# Altium project Control.PrjPCB
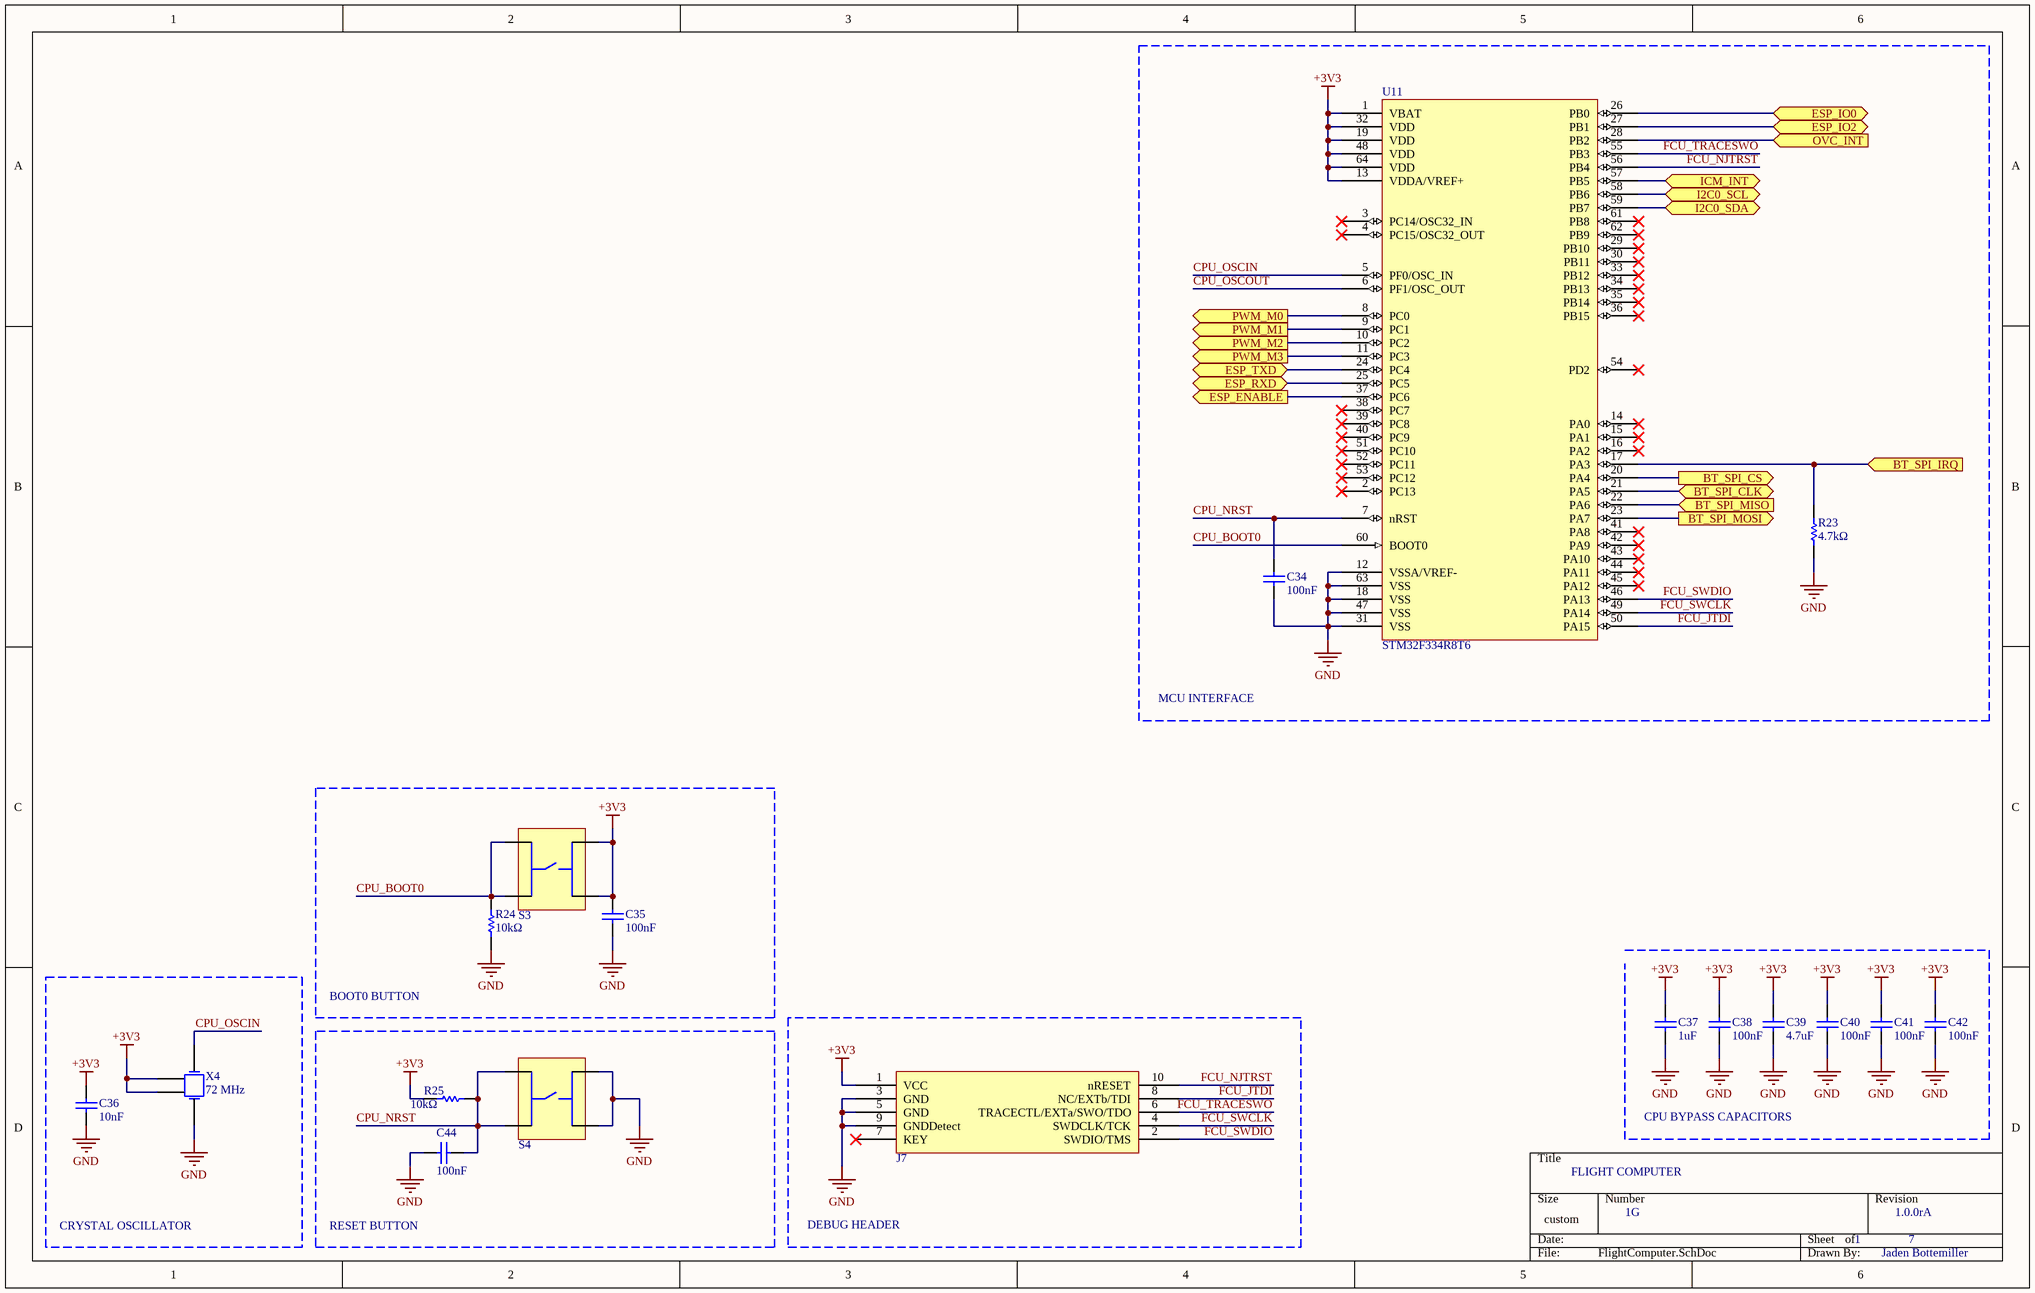
[diagram p0: FlightComputer.SchDoc]
7 sheets, 196 parts. Net scope: flat (ports and power ports of the same name join across sheets).
Sheets:
  FlightComputer.SchDoc
  DebugProbe.SchDoc
  MotionSense.SchDoc
  WirelessConnectivity.SchDoc
  BluetoothConnectivity.SchDoc
  PowerRegulation.SchDoc
  AuxilliaryLEDs.SchDoc

## Sheet FlightComputer.SchDoc
size 381 x 241 mm

### Parts
C34  value 100nF  (hidden comment: CAP)
C35  value 100nF  (hidden comment: CAP)
C36  value 10nF  (hidden comment: CAP)
C37  value 1uF  (hidden comment: CAP)
C38  value 100nF  (hidden comment: CAP)
C39  value 4.7uF  (hidden comment: CAP)
C40  value 100nF  (hidden comment: CAP)
C41  value 100nF  (hidden comment: CAP)
C42  value 100nF  (hidden comment: CAP)
C44  value 100nF  (hidden comment: CAP)
J7  Debug Connector  (value not drawn)
R23  value 4.7kΩ  (hidden comment: RES)
R24  value 10kΩ  (hidden comment: RES)
R25  value 10kΩ  (hidden comment: RES)
S3  Pushbutton  (value not drawn)
S4  Pushbutton  (value not drawn)
U11  STM32F334R8T6
X4  value 72 MHz  (hidden comment: Crystal Oscillator)

### Blocks framed on the sheet
MCU INTERFACE: C34 R23 U11
BOOT0 BUTTON: C35 R24 S3
CRYSTAL OSCILLATOR: C36 X4
RESET BUTTON: C44 R25 S4
DEBUG HEADER: J7

### Ports
BT_SPI_CLK (bidir), BT_SPI_CS (out), BT_SPI_IRQ (in), BT_SPI_MISO (in), BT_SPI_MOSI (out), ESP_ENABLE (out), ESP_IO0 (bidir), ESP_IO2 (bidir), ESP_RXD (bidir), ESP_TXD (bidir), I2C0_SCL (bidir), I2C0_SDA (bidir), ICM_INT (bidir), OVC_INT (in), PWM_M0 (out), PWM_M1 (out), PWM_M2 (out), PWM_M3 (out)

### Nets
+3V3: C35.1 C36.1 C37.2 C38.2 C39.2 C40.2 C41.2 C42.2 J7.1(VCC) R25.1 S3.3(Pin) S3.4(Pin) U11.1(VBAT) U11.13(VDDA/VREF+) U11.19(VDD) U11.32(VDD) U11.48(VDD) U11.64(VDD) X4.2(GND) X4.4(GND)  [project net VDDA_WA]
GND: C34.1 C35.2 C36.2 C37.1 C38.1 C39.1 C40.1 C41.1 C42.1 C44.2 J7.3(GND) J7.5(GND) J7.9(GNDDetect) R23.1 R24.1 S4.3(Pin) S4.4(Pin) U11.12(VSSA/VREF-) U11.18(VSS) U11.31(VSS) U11.47(VSS) U11.63(VSS) X4.3(X2)  [project net BT_NO_SMPS]
CPU_BOOT0: R24.2 S3.1 S3.2(Pin) U11.60(BOOT0)
CPU_NRST: C34.2 C44.1 R25.2 S4.1 S4.2(Pin) U11.7(nRST)
CPU_OSCIN: U11.5(PF0/OSC_IN) X4.1(X1)
CPU_OSCOUT: U11.6(PF1/OSC_OUT)
FCU_JTDI: J7.8(NC/EXTb/TDI) U11.50(PA15)
FCU_NJTRST: J7.10(nRESET) U11.56(PB4)
FCU_SWCLK: J7.4(SWDCLK/TCK) U11.49(PA14)
FCU_SWDIO: J7.2(SWDIO/TMS) U11.46(PA13)
FCU_TRACESWO: J7.6(TRACECTL/EXTa/SWO/TDO) U11.55(PB3)
NetJ2_3: U11.21(PA5) ; port BT_SPI_CLK
NetJ2_4: U11.23(PA7) ; port BT_SPI_MOSI
NetJ2_5: U11.22(PA6) ; port BT_SPI_MISO
NetJ2_6: U11.20(PA4) ; port BT_SPI_CS
NetJ2_7: R23.2 U11.17(PA3) ; port BT_SPI_IRQ
NetJ8_4: U11.8(PC0) ; port PWM_M0
NetJ8_5: U11.9(PC1) ; port PWM_M1
NetJ8_6: U11.10(PC2) ; port PWM_M2
NetJ8_7: U11.11(PC3) ; port PWM_M3
NetJ8_10: U11.58(PB6) ; port I2C0_SCL
NetJ8_11: U11.59(PB7) ; port I2C0_SDA
NetJ8_12: U11.28(PB2) ; port OVC_INT
NetJ10_3: U11.24(PC4) ; port ESP_TXD
NetJ10_4: U11.37(PC6) ; port ESP_ENABLE
NetJ10_6: U11.27(PB1) ; port ESP_IO2
NetJ10_7: U11.26(PB0) ; port ESP_IO0
NetJ10_8: U11.25(PC5) ; port ESP_RXD
NetU11_57: U11.57(PB5) ; port ICM_INT

Not connected (* = marked no-connect by the designer): J7 7(KEY)*; U11 2(PC13)* 3(PC14/OSC32_IN)* 4(PC15/OSC32_OUT)* 14(PA0)* 15(PA1)* 16(PA2)* 29(PB10)* 30(PB11)* 33(PB12)* 34(PB13)* 35(PB14)* 36(PB15)* 38(PC7)* 39(PC8)* 40(PC9)* 41(PA8)* 42(PA9)* 43(PA10)* 44(PA11)* 45(PA12)* 51(PC10)* 52(PC11)* 53(PC12)* 54(PD2)* 61(PB8)* 62(PB9)*

### Notes on the sheet
- FLIGHT COMPUTER
- CPU BYPASS CAPACITORS
- 1G
- 1
- 1.0.0rA
- 7
- Jaden Bottemiller

### Library data of the parts
C34-C42 C44 = CAP: Standard Capacitor
J7 = Cortex-M Debug: 10-Pin Cortex-M Debug Connector
R23-R25 = RES: Standard Resistor
S3 S4 = PUSHBTN_4T: Standard Pushbutton with 4 Terminals
U11 = STM32F334R8T6: ARM® Cortex®-M4 STM32F3 Microcontroller IC 32-Bit 72MHz 64KB (64K x 8) FLASH 64-LQFP (10x10); ComponentLink1Description: DigiKey; ComponentLink1URL: https://www.digikey.com/product-detail/en/stmicroelectronics/STM32F334R8T6/497-14955-ND/4989177; ComponentLink2Description: Datasheet; ComponentLink2URL: https://www.st.com/content/ccc/resource/technical/document/datasheet/d1/cd/3d/18/a2/2c/4e/d0/DM00097745.pdf/files/DM00097745.pdf/jcr:content/translations/en.DM00097745.pdf
X4 = OSC_2GND: Standard Crystal Oscillator with two ground connections.

## Sheet DebugProbe.SchDoc
size 381 x 241 mm
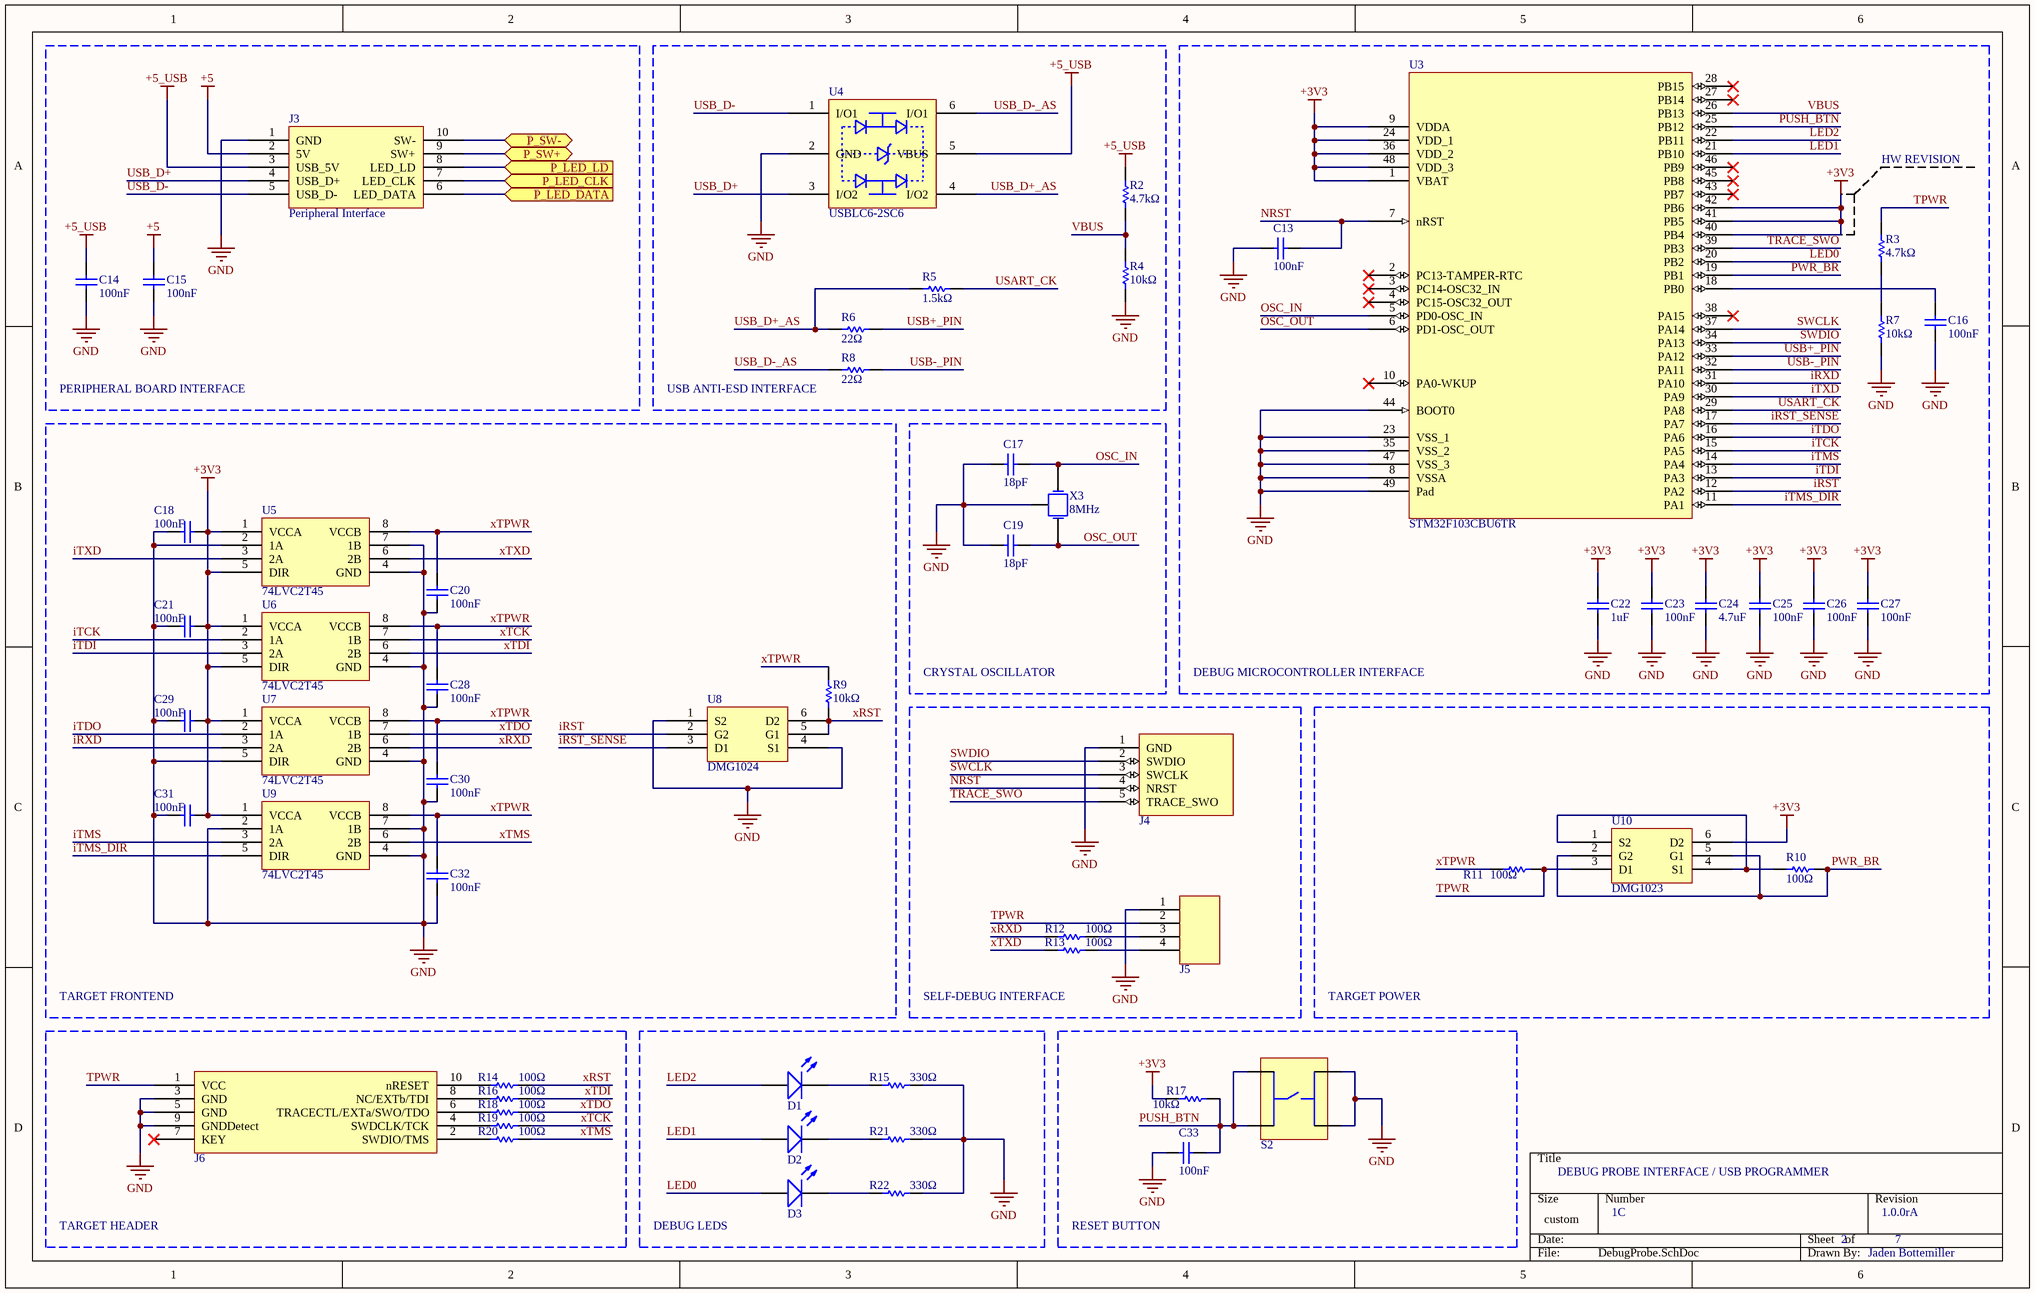
[diagram p1: DebugProbe.SchDoc]

### Parts
C13  value 100nF  (hidden comment: CAP)
C14  value 100nF  (hidden comment: CAP)
C15  value 100nF  (hidden comment: CAP)
C16  value 100nF  (hidden comment: CAP)
C17  value 18pF  (hidden comment: CAP)
C18  value 100nF  (hidden comment: CAP)
C19  value 18pF  (hidden comment: CAP)
C20  value 100nF  (hidden comment: CAP)
C21  value 100nF  (hidden comment: CAP)
C22  value 1uF  (hidden comment: CAP)
C23  value 100nF  (hidden comment: CAP)
C24  value 4.7uF  (hidden comment: CAP)
C25  value 100nF  (hidden comment: CAP)
C26  value 100nF  (hidden comment: CAP)
C27  value 100nF  (hidden comment: CAP)
C28  value 100nF  (hidden comment: CAP)
C29  value 100nF  (hidden comment: CAP)
C30  value 100nF  (hidden comment: CAP)
C31  value 100nF  (hidden comment: CAP)
C32  value 100nF  (hidden comment: CAP)
C33  value 100nF  (hidden comment: CAP)
D1  LED  (value not drawn)
D2  LED  (value not drawn)
D3  LED  (value not drawn)
J3  Peripheral Interface
J4  Debug Header  (value not drawn)
J5  4 Pin Connector  (value not drawn)
J6  Debug Connector  (value not drawn)
R2  value 4.7kΩ  (hidden comment: RES)
R3  value 4.7kΩ  (hidden comment: RES)
R4  value 10kΩ  (hidden comment: RES)
R5  value 1.5kΩ  (hidden comment: RES)
R6  value 22Ω  (hidden comment: RES)
R7  value 10kΩ  (hidden comment: RES)
R8  value 22Ω  (hidden comment: RES)
R9  value 10kΩ  (hidden comment: RES)
R10  value 100Ω  (hidden comment: RES)
R11  value 100Ω  (hidden comment: RES)
R12  value 100Ω  (hidden comment: RES)
R13  value 100Ω  (hidden comment: RES)
R14  value 100Ω  (hidden comment: RES)
R15  value 330Ω  (hidden comment: RES)
R16  value 100Ω  (hidden comment: RES)
R17  value 10kΩ  (hidden comment: RES)
R18  value 100Ω  (hidden comment: RES)
R19  value 100Ω  (hidden comment: RES)
R20  value 100Ω  (hidden comment: RES)
R21  value 330Ω  (hidden comment: RES)
R22  value 330Ω  (hidden comment: RES)
S2  Pushbutton  (value not drawn)
U3  STM32F103CBU6TR
U4  USBLC6-2SC6
U5  74LVC2T45
U6  74LVC2T45
U7  74LVC2T45
U8  DMG1024
U9  74LVC2T45
U10  DMG1023
X3  value 8MHz  (hidden comment: Crystal Oscillator)

### Blocks framed on the sheet
PERIPHERAL BOARD INTERFACE: C14 C15 J3
USB ANTI-ESD INTERFACE: R2 R4-R6 R8 U4
TARGET FRONTEND: C18 C20 C21 C28-C32 R9 U5-U9
CRYSTAL OSCILLATOR: C17 C19 X3
SELF-DEBUG INTERFACE: J4 J5 R12 R13
TARGET POWER: R10 R11 U10
TARGET HEADER: J6 R14 R16 R18-R20
DEBUG LEDS: D1-D3 R15 R21 R22
RESET BUTTON: C33 R17 S2

### Ports
P_LED_CLK (in), P_LED_DATA (in), P_LED_LD (in), P_SW+ (bidir), P_SW- (bidir)

### Nets
+3V3: C18.1 C21.1 C22.2 C23.2 C24.2 C25.2 C26.2 C27.2 C29.1 C31.1 R17.1 U3.1(VBAT) U3.9(VDDA) U3.24(VDD_1) U3.36(VDD_2) U3.40(PB4) U3.41(PB5) U3.42(PB6) U3.48(VDD_3) U5.1(VCCA) U5.5(DIR) U6.1(VCCA) U6.5(DIR) U7.1(VCCA) U9.1(VCCA) U10.6(D2)  [project net VDDA_WA]
+5: C15.2 J3.2(5V)
+5_USB: C14.2 J3.3(USB_5V) R2.2 U4.5(VBUS)
GND: C13.1 C14.1 C15.1 C16.1 C17.2 C18.2 C19.2 C20.2 C21.2 C22.1 C23.1 C24.1 C25.1 C26.1 C27.1 C28.2 C29.2 C30.2 C31.2 C32.2 C33.2 J3.1(GND) J4.1(GND) J5.1(Pin) J6.3(GND) J6.5(GND) J6.9(GNDDetect) R4.1 R7.1 R15.1 R21.1 R22.1 S2.3(Pin) S2.4(Pin) U3.8(VSSA) U3.23(VSS_1) U3.35(VSS_2) U3.44(BOOT0) U3.47(VSS_3) U3.49(Pad) U4.2(GND) U5.2(1A) U5.4(GND) U5.7(1B) U6.4(GND) U7.4(GND) U7.5(DIR) U8.1(S2) U8.4(S1) U9.2(1A) U9.4(GND) U9.7(1B) X3.3(GND)  [project net BT_NO_SMPS]
iRST: U3.12(PA2) U8.2(G2)
iRST_SENSE: U3.17(PA7) U8.3(D1)
iRXD: U3.31(PA10) U7.3(2A)
iTCK: U3.15(PA5) U6.2(1A)
iTDI: U3.13(PA3) U6.3(2A)
iTDO: U3.16(PA6) U7.2(1A)
iTMS: U3.14(PA4) U9.3(2A)
iTMS_DIR: U3.11(PA1) U9.5(DIR)
iTXD: U3.30(PA9) U5.3(2A)
LED0: D3.2(A) U3.20(PB2)
LED1: D2.2(A) U3.21(PB10)
LED2: D1.2(A) U3.22(PB11)
NRST: C13.2 J4.4(NRST) U3.7(nRST)
OSC_IN: C17.1 U3.5(PD0-OSC_IN) X3.1(X1)
OSC_OUT: C19.1 U3.6(PD1-OSC_OUT) X3.2(X2)
PUSH_BTN: C33.1 R17.2 S2.1 S2.2(Pin) U3.25(PB12)
PWR_BR: R10.2 U3.19(PB1) U10.2(G2) U10.5(G1)
SWCLK: J4.3(SWCLK) U3.37(PA14)
SWDIO: J4.2(SWDIO) U3.34(PA13)
TPWR: J5.2(Pin) J6.1(VCC) R3.2 R11.2 U10.3(D1)
TRACE_SWO: J4.5(TRACE_SWO) U3.39(PB3)
USART_CK: R5.1 U3.29(PA8)
USB+_PIN: R6.1 U3.33(PA12)
USB-_PIN: R8.1 U3.32(PA11)
USB_D+: J3.4(USB_D+) U4.3(I/O2)
USB_D+_AS: R5.2 R6.2 U4.4(I/O2)
USB_D-: J3.5(USB_D-) U4.1(I/O1)
USB_D-_AS: R8.2 U4.6(I/O1)
VBUS: R2.1 R4.2 U3.26(PB13)
xRST: R9.2 R14.1 U8.5(G1) U8.6(D2)
xRXD: R12.2 U7.6(2B)
xTCK: R19.1 U6.7(1B)
xTDI: R16.1 U6.6(2B)
xTDO: R18.1 U7.7(1B)
xTMS: R20.1 U9.6(2B)
xTPWR: C20.1 C28.1 C30.1 C32.1 R9.1 R11.1 U5.8(VCCB) U6.8(VCCB) U7.8(VCCB) U9.8(VCCB)
xTXD: R13.2 U5.6(2B)
NetC16_2: C16.2 U3.18(PB0)
NetD1_1: D1.1(K) R15.2
NetD2_1: D2.1(K) R21.2
NetD3_1: D3.1(K) R22.2
NetJ3_6: J3.6(LED_DATA) ; port P_LED_DATA
NetJ3_7: J3.7(LED_CLK) ; port P_LED_CLK
NetJ3_8: J3.8(LED_LD) ; port P_LED_LD
NetJ3_9: J3.9(SW+) ; port P_SW+
NetJ3_10: J3.10(SW-) ; port P_SW-
NetJ5_3: J5.3(Pin) R12.1
NetJ5_4: J5.4(Pin) R13.1
NetJ6_2: J6.2(SWDIO/TMS) R20.2
NetJ6_4: J6.4(SWDCLK/TCK) R19.2
NetJ6_6: J6.6(TRACECTL/EXTa/SWO/TDO) R18.2
NetJ6_8: J6.8(NC/EXTb/TDI) R16.2
NetJ6_10: J6.10(nRESET) R14.2
NetR3_1: R3.1 R7.2
NetR10_1: R10.1 U10.1(S2) U10.4(S1)

Not connected (* = marked no-connect by the designer): J6 7(KEY)*; U3 2(PC13-TAMPER-RTC)* 3(PC14-OSC32_IN)* 4(PC15-OSC32_OUT)* 10(PA0-WKUP)* 27(PB14)* 28(PB15)* 38(PA15)* 43(PB7)* 45(PB8)* 46(PB9)*

### Notes on the sheet
- HW REVISION
- DEBUG MICROCONTROLLER INTERFACE
- DEBUG PROBE INTERFACE / USB PROGRAMMER
- 1C
- 2
- 1.0.0rA
- 7
- Jaden Bottemiller

### Library data of the parts
C13-C33 = CAP: Standard Capacitor
D1 = LED: Standard LED
D2 = LED: Standard LED; Color: Orange
D3 = LED: Standard LED; Color: YELLOW
J3 = PERIPHERAL_INTERFACE: Interface between peripheral board and control board.
J4 = DBG_5PIN: Five pin Debug Header SWD
J5 = CONN_4PIN: Standard 4 Pin Connector
J6 = Cortex-M Debug: 10-Pin Cortex-M Debug Connector
R2-R22 = RES: Standard Resistor
S2 = PUSHBTN_4T: Standard Pushbutton with 4 Terminals
U3 = STM32F103CBU6TR: IC MCU 32BIT 128KB FLASH LQFP48; ComponentLink1Description: DigiKey; ComponentLink1URL: https://www.digikey.com/product-detail/en/stmicroelectronics/STM32F103CBU6TR/497-18757-1-ND/9958418; ComponentLink2Description: Datasheet; ComponentLink2URL: https://www.st.com/resource/en/datasheet/stm32f103cb.pdf
U4 = USBLC6-2: 17V Clamp 5A (8/20µs) Ipp TVS Diode; ComponentLink1Description: DigiKey; ComponentLink1URL: https://www.digikey.com/product-detail/en/stmicroelectronics/USBLC6-2SC6/497-5235-1-ND/1121688; ComponentLink2Description: Datasheet; ComponentLink2URL: https://www.st.com/content/ccc/resource/technical/document/datasheet/06/1d/48/9c/6c/20/4a/b2/CD00050750.pdf/files/CD00050750.pdf/jcr:content/translations/en.CD00050750.pdf
U5-U7 U9 = 74LVC2T45: Voltage Level Translator Bidirectional 1 Circuit 2 Channel 420Mbps 8-XSON; ComponentLink1Description: DigiKey; ComponentLink1URL: https://www.digikey.com/product-detail/en/nexperia-usa-inc/74LVC2T45GT115/1727-4581-1-ND/2530960; ComponentLink2Description: Datasheet; ComponentLink2URL: https://assets.nexperia.com/documents/data-sheet/74LVC_LVCH2T45.pdf
U8 = DMG1024: Mosfet Array 2 N-Channel (Dual) 20V 1.38A 530mW Surface Mount SOT-563; ComponentLink3Description: DigiKey; ComponentLink3URL: https://www.digikey.com/product-detail/en/diodes-incorporated/DMG1024UV-7/DMG1024UV-7DICT-ND/2270855; ComponentLink4Description: Datasheet; ComponentLink4URL: https://www.diodes.com/assets/Datasheets/ds31974.pdf
U10 = DMG1023: Mosfet Array 2 P-Channel (Dual) 20V 1.03A 530mW Surface Mount SOT-563; ComponentLink1Description: DigiKey; ComponentLink1URL: https://www.digikey.com/product-detail/en/diodes-incorporated/DMG1023UV-7/DMG1023UV-7DICT-ND/2270854; ComponentLink2Description: Datasheet; ComponentLink2URL: https://www.diodes.com/assets/Datasheets/ds31975.pdf
X3 = OSC_1GND: Standard Crystal Oscillator with a ground connection.

## Sheet MotionSense.SchDoc
size 381 x 241 mm
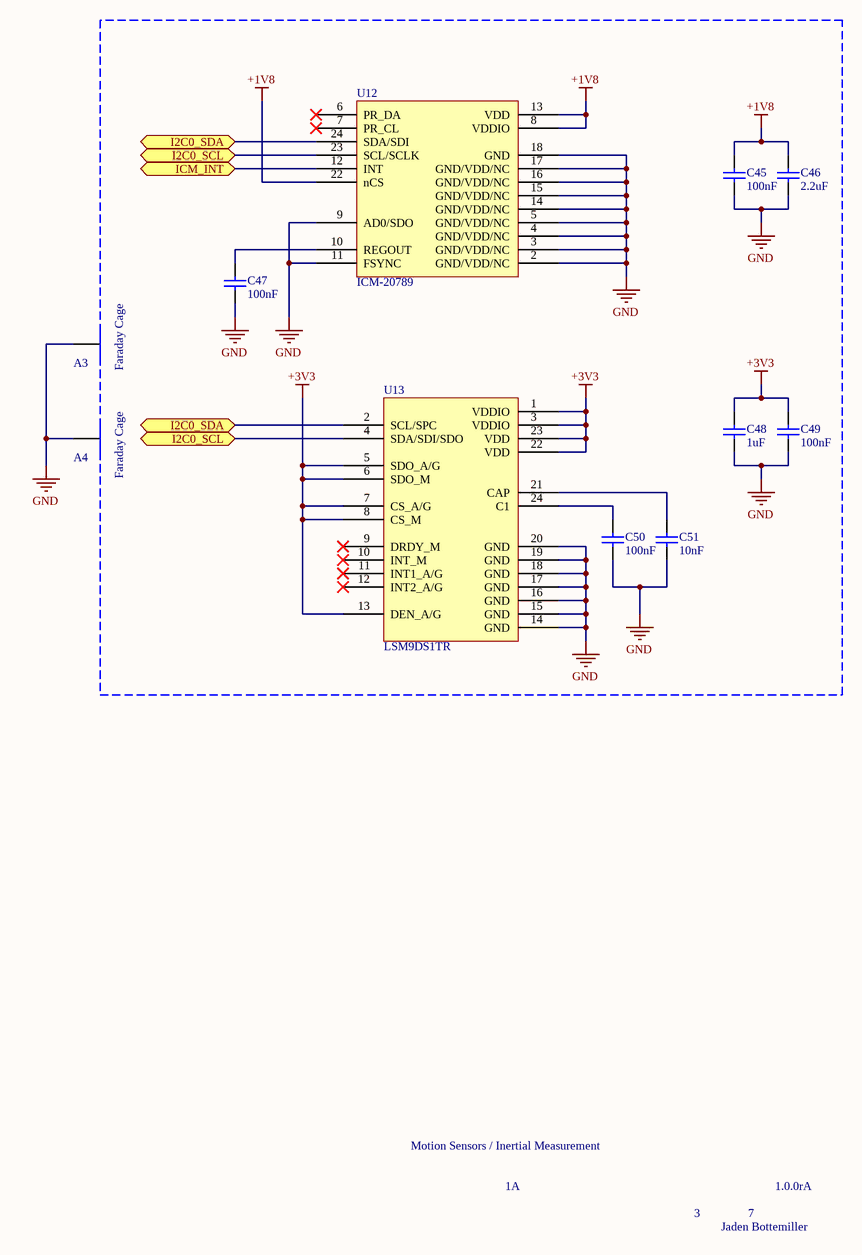
[diagram p2: MotionSense.SchDoc]

### Parts
A3  Faraday Cage
A4  Faraday Cage
C45  value 100nF  (hidden comment: CAP)
C46  value 2.2uF  (hidden comment: CAP)
C47  value 100nF  (hidden comment: CAP)
C48  value 1uF  (hidden comment: CAP)
C49  value 100nF  (hidden comment: CAP)
C50  value 100nF  (hidden comment: CAP)
C51  value 10nF  (hidden comment: CAP)
U12  ICM-20789
U13  LSM9DS1TR

### Ports
I2C0_SCL (bidir), I2C0_SDA (bidir), ICM_INT (bidir)

### Nets
+1V8: C45.2 C46.2 U12.8(VDDIO) U12.13(VDD) U12.22(nCS)
+3V3: C48.2 C49.2 U13.1(VDDIO) U13.3(VDDIO) U13.5(SDO_A/G) U13.6(SDO_M) U13.7(CS_A/G) U13.8(CS_M) U13.13(DEN_A/G) U13.22(VDD) U13.23(VDD)  [project net VDDA_WA]
GND: A3.1(Pin) A4.1(Pin) C45.1 C46.1 C47.1 C48.1 C49.1 C50.1 C51.1 U12.2(GND/VDD/NC) U12.3(GND/VDD/NC) U12.4(GND/VDD/NC) U12.5(GND/VDD/NC) U12.9(AD0/SDO) U12.11(FSYNC) U12.14(GND/VDD/NC) U12.15(GND/VDD/NC) U12.16(GND/VDD/NC) U12.17(GND/VDD/NC) U12.18(GND) U13.14(GND) U13.15(GND) U13.16(GND) U13.17(GND) U13.18(GND) U13.19(GND) U13.20(GND)  [project net BT_NO_SMPS]
NetC47_2: C47.2 U12.10(REGOUT)
NetC50_2: C50.2 U13.24(C1)
NetC51_2: C51.2 U13.21(CAP)
NetJ8_10: U12.23(SCL/SCLK) U13.4(SDA/SDI/SDO) ; port I2C0_SCL
NetJ8_11: U12.24(SDA/SDI) U13.2(SCL/SPC) ; port I2C0_SDA
NetU11_57: U12.12(INT) ; port ICM_INT

Not connected (* = marked no-connect by the designer): U12 1(NC) 6(PR_DA)* 7(PR_CL)* 19(NC) 20(NC) 21(NC); U13 9(DRDY_M)* 10(INT_M)* 11(INT1_A/G)* 12(INT2_A/G)*

### Notes on the sheet
- Motion Sensors / Inertial Measurement
- 1A
- 3
- 7
- 1.0.0rA
- Jaden Bottemiller

### Library data of the parts
A3 A4 = Faraday Cage: Standard Faraday Cage
C45-C51 = CAP: Standard Capacitor
U12 = ICM-20789: Accelerometer, Gyroscope, Barometric Pressure Sensor. 3-Axis I2C; ComponentLink1Description: DigiKey; ComponentLink1URL: https://www.digikey.com/product-detail/en/tdk-invensense/ICM-20789/1428-1133-1-ND/7794714; ComponentLink2Description: Datasheet; ComponentLink2URL: http://www.invensense.com/wp-content/uploads/2017/10/DS-000169-ICM-20789-TYP-v1.3.pdf
U13 = LSM9DS1TR: Accelerometer, Gyroscope, Magnetometer, Temperature, 3 Axis Sensor I²C, SPI Output; ComponentLink1Description: DigiKey; ComponentLink1URL: https://www.digikey.com/product-detail/en/stmicroelectronics/LSM9DS1TR/497-14946-1-ND/4988079; ComponentLink2Description: Datasheet; ComponentLink2URL: https://www.st.com/content/ccc/resource/technical/document/datasheet/1e/3f/2a/d6/25/eb/48/46/DM00103319.pdf/files/DM00103319.pdf/jcr:content/translations/en.DM00103319.pdf

## Sheet WirelessConnectivity.SchDoc
size 381 x 241 mm
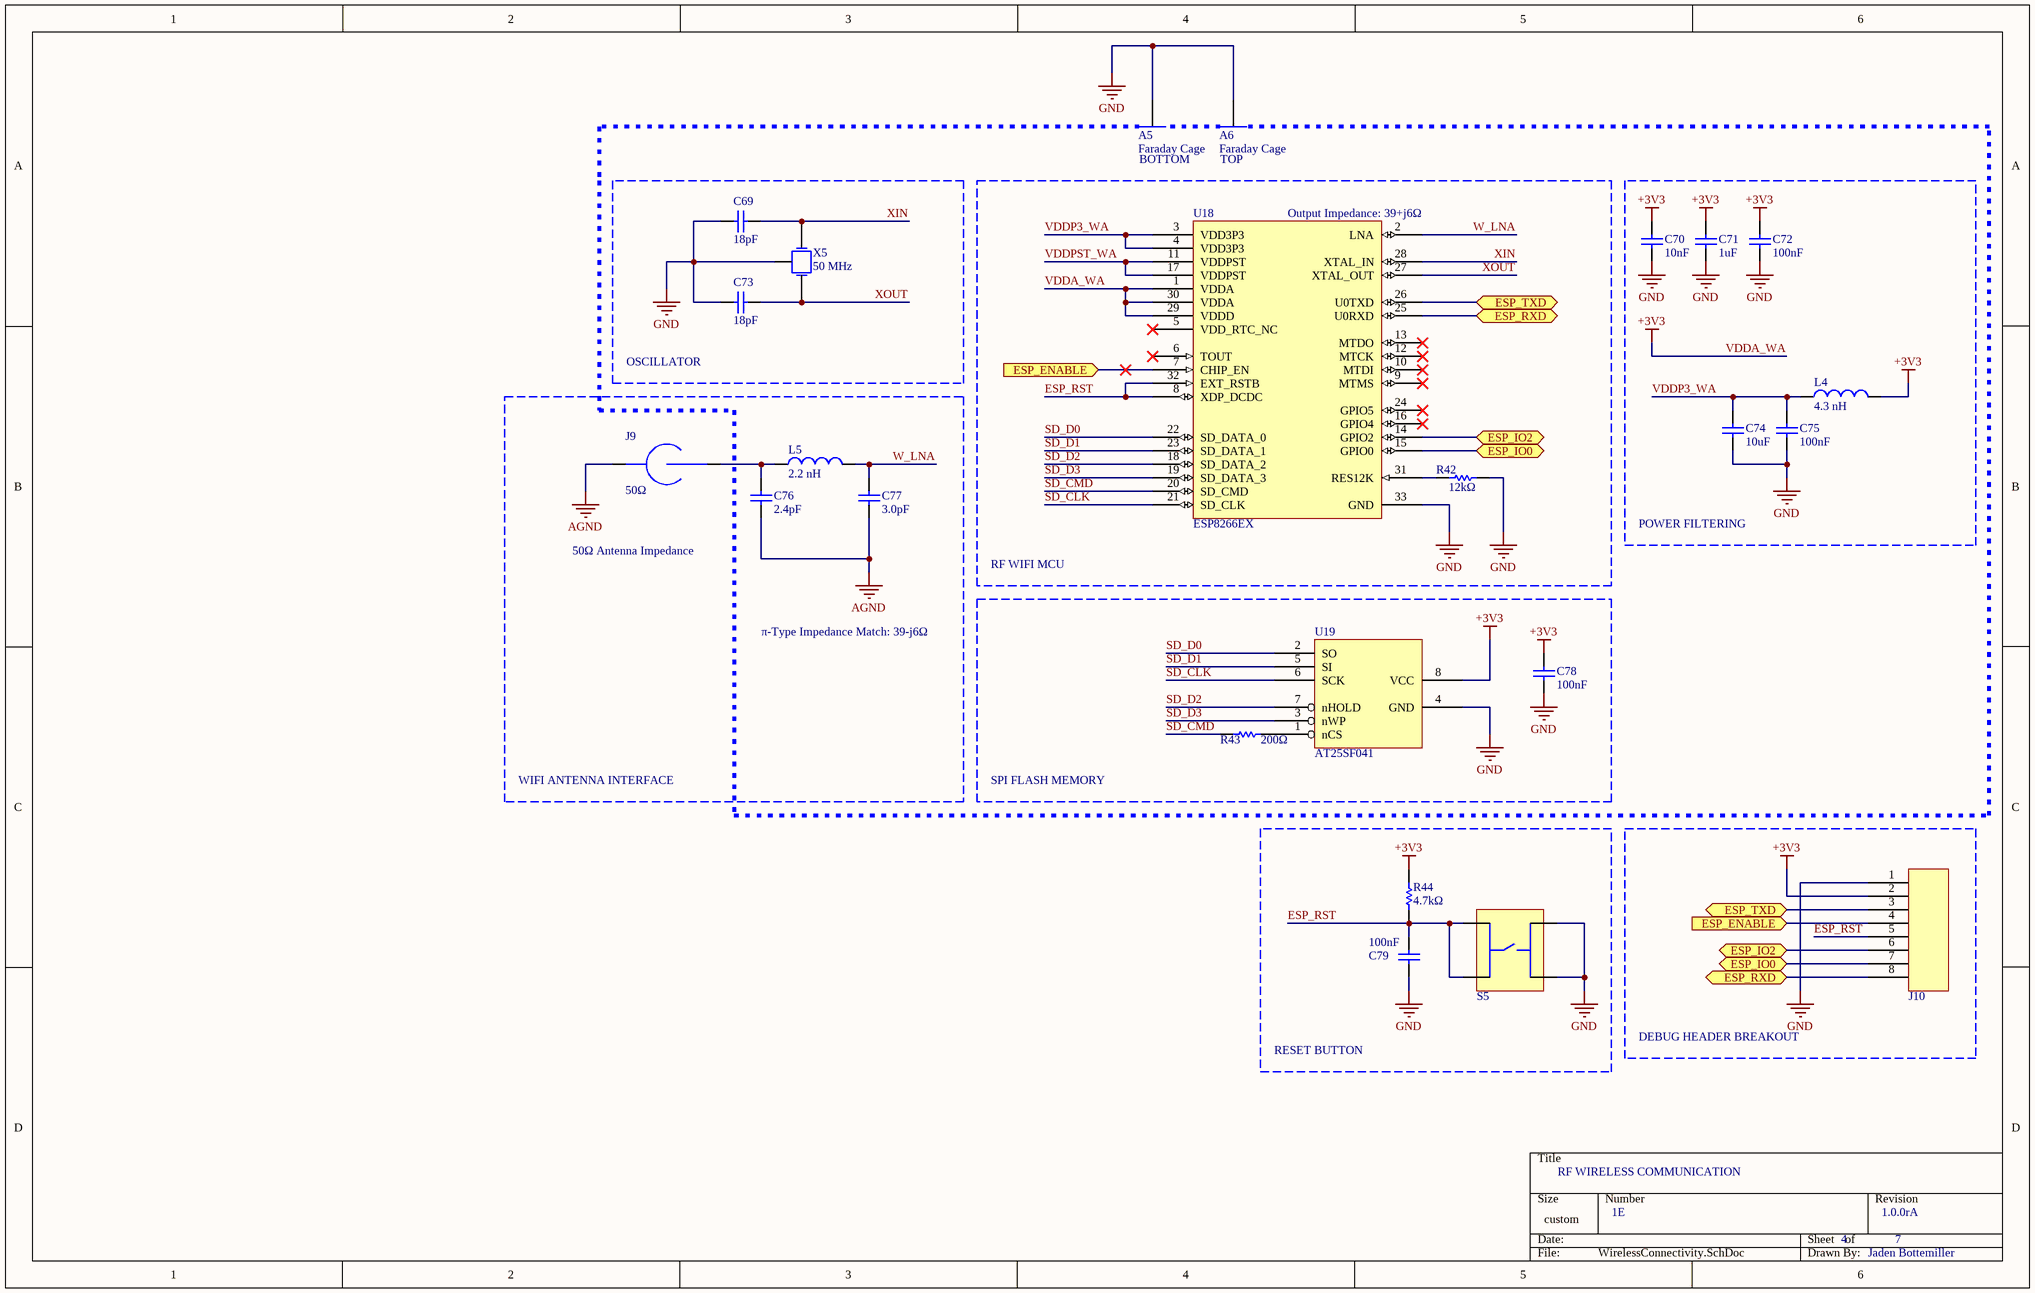
[diagram p3: WirelessConnectivity.SchDoc]

### Parts
A5  Faraday Cage
A6  Faraday Cage
C69  value 18pF  (hidden comment: CAP)
C70  value 10nF  (hidden comment: CAP)
C71  value 1uF  (hidden comment: CAP)
C72  value 100nF  (hidden comment: CAP)
C73  value 18pF  (hidden comment: CAP)
C74  value 10uF  (hidden comment: CAP)
C75  value 100nF  (hidden comment: CAP)
C76  value 2.4pF  (hidden comment: CAP)
C77  value 3.0pF  (hidden comment: CAP)
C78  value 100nF  (hidden comment: CAP)
C79  value 100nF  (hidden comment: CAP)
J9  Impedance: 50Ω  (hidden comment: Coaxial Connection)
J10  8 Pin Connector  (value not drawn)
L4  value 4.3 nH  (hidden comment: IND)
L5  value 2.2 nH  (hidden comment: IND)
R42  value 12kΩ  (hidden comment: RES)
R43  value 200Ω  (hidden comment: RES)
R44  value 4.7kΩ  (hidden comment: RES)
S5  Pushbutton  (value not drawn)
U18  ESP8266EX
U19  AT25SF041
X5  value 50 MHz  (hidden comment: Crystal Oscillator)

### Blocks framed on the sheet
OSCILLATOR: C69 C73 X5
POWER FILTERING: C70-C72 C74 C75 L4
SPI FLASH MEMORY: C78 R43 U19
RESET BUTTON: C79 R44 S5
DEBUG HEADER BREAKOUT: J10

### Ports
ESP_ENABLE (in), ESP_IO0 (bidir), ESP_IO2 (bidir), ESP_RXD (bidir), ESP_TXD (bidir)

### Nets
AGND: C76.1 C77.1 J9.2
GND: A5.1(Pin) A6.1(Pin) C69.2 C70.1 C71.1 C72.1 C73.2 C74.1 C75.1 C78.1 C79.1 J10.1(Pin) R42.2 S5.3(Pin) S5.4(Pin) U18.33(GND) U19.4(GND) X5.3(GND)  [project net BT_NO_SMPS]
VDDA_WA: C70.2 C71.2 C72.2 C78.2 J10.2(Pin) L4.2 R44.2 U18.1(VDDA) U18.29(VDDD) U18.30(VDDA) U19.8(VCC)  [also labelled +3V3]
ESP_RST: C79.2 J10.5(Pin) R44.1 S5.1 S5.2(Pin) U18.8(XDP_DCDC) U18.32(EXT_RSTB)
SD_CLK: U18.21(SD_CLK) U19.6(SCK)
SD_CMD: R43.1 U18.20(SD_CMD)
SD_D0: U18.22(SD_DATA_0) U19.2(SO)
SD_D1: U18.23(SD_DATA_1) U19.5(SI)
SD_D2: U18.18(SD_DATA_2) U19.7(nHOLD)
SD_D3: U18.19(SD_DATA_3) U19.3(nWP)
VDDP3_WA: C74.2 C75.2 L4.1 U18.3(VDD3P3) U18.4(VDD3P3)
VDDPST_WA: U18.11(VDDPST) U18.17(VDDPST)
W_LNA: C77.2 L5.2 U18.2(LNA)
XIN: C69.1 U18.28(XTAL_IN) X5.1(X1)
XOUT: C73.1 U18.27(XTAL_OUT) X5.2(X2)
NetC76_2: C76.2 J9.1(Pin) L5.1
NetJ10_3: J10.3(Pin) U18.26(U0TXD) ; port ESP_TXD
NetJ10_4: J10.4(Pin) U18.7(CHIP_EN) ; port ESP_ENABLE
NetJ10_6: J10.6(Pin) U18.14(GPIO2) ; port ESP_IO2
NetJ10_7: J10.7(Pin) U18.15(GPIO0) ; port ESP_IO0
NetJ10_8: J10.8(Pin) U18.25(U0RXD) ; port ESP_RXD
NetR42_1: R42.1 U18.31(RES12K)
NetR43_2: R43.2 U19.1(nCS)

Not connected (* = marked no-connect by the designer): U18 5(VDD_RTC_NC)* 6(TOUT)* 9(MTMS)* 10(MTDI)* 12(MTCK)* 13(MTDO)* 16(GPIO4)* 24(GPIO5)*

### Notes on the sheet
- (near A5) BOTTOM
- (near A6) TOP
- (near U18) Output Impedance: 39+j6Ω
- 50Ω Antenna Impedance
- RF WIFI MCU
- π-Type Impedance Match: 39-j6Ω
- WIFI ANTENNA INTERFACE
- RF WIRELESS COMMUNICATION
- 1E
- 4
- 1.0.0rA
- 7
- Jaden Bottemiller

### Library data of the parts
A5 A6 = Faraday Cage: Standard Faraday Cage
C69-C79 = CAP: Standard Capacitor
J9 = COAX: Coaxial Connection, e.g. to antennae
J10 = CONN_8PIN: Standard 8 Pin Connector
L4 L5 = IND: Standard Inductor
R42 R44 = RES: Standard Resistor; Tolerance: 1%
R43 = RES: Standard Resistor
S5 = PUSHBTN_4T: Standard Pushbutton with 4 Terminals
U18 = ESP8266EX: IC RF TxRx + MCU WiFi 802.11b/g/n 2.4GHz; ComponentLink1Description: DigiKey; ComponentLink1URL: https://www.digikey.com/product-detail/en/espressif-systems/ESP8266EX/1904-1001-1-ND/8028408; ComponentLink2Description: Datasheet; ComponentLink2URL: https://www.espressif.com/sites/default/files/documentation/0a-esp8266ex_datasheet_en.pdf
U19 = AT25SF041: FLASH Memory IC 4Mb (512K x 8) SPI 104MHz  8-SOIC; ComponentLink1Description: DigiKey; ComponentLink1URL: https://www.digikey.com/product-detail/en/active-semi-international-inc/ACT4060ASH-T/1488-1107-1-ND/7897251; ComponentLink2Description: Datasheet; ComponentLink2URL: https://active-semi.com/wp-content/uploads/ACT4060A_Datasheet.pdf
X5 = OSC_1GND: as X3 on sheet DebugProbe

## Sheet BluetoothConnectivity.SchDoc
size 381 x 241 mm
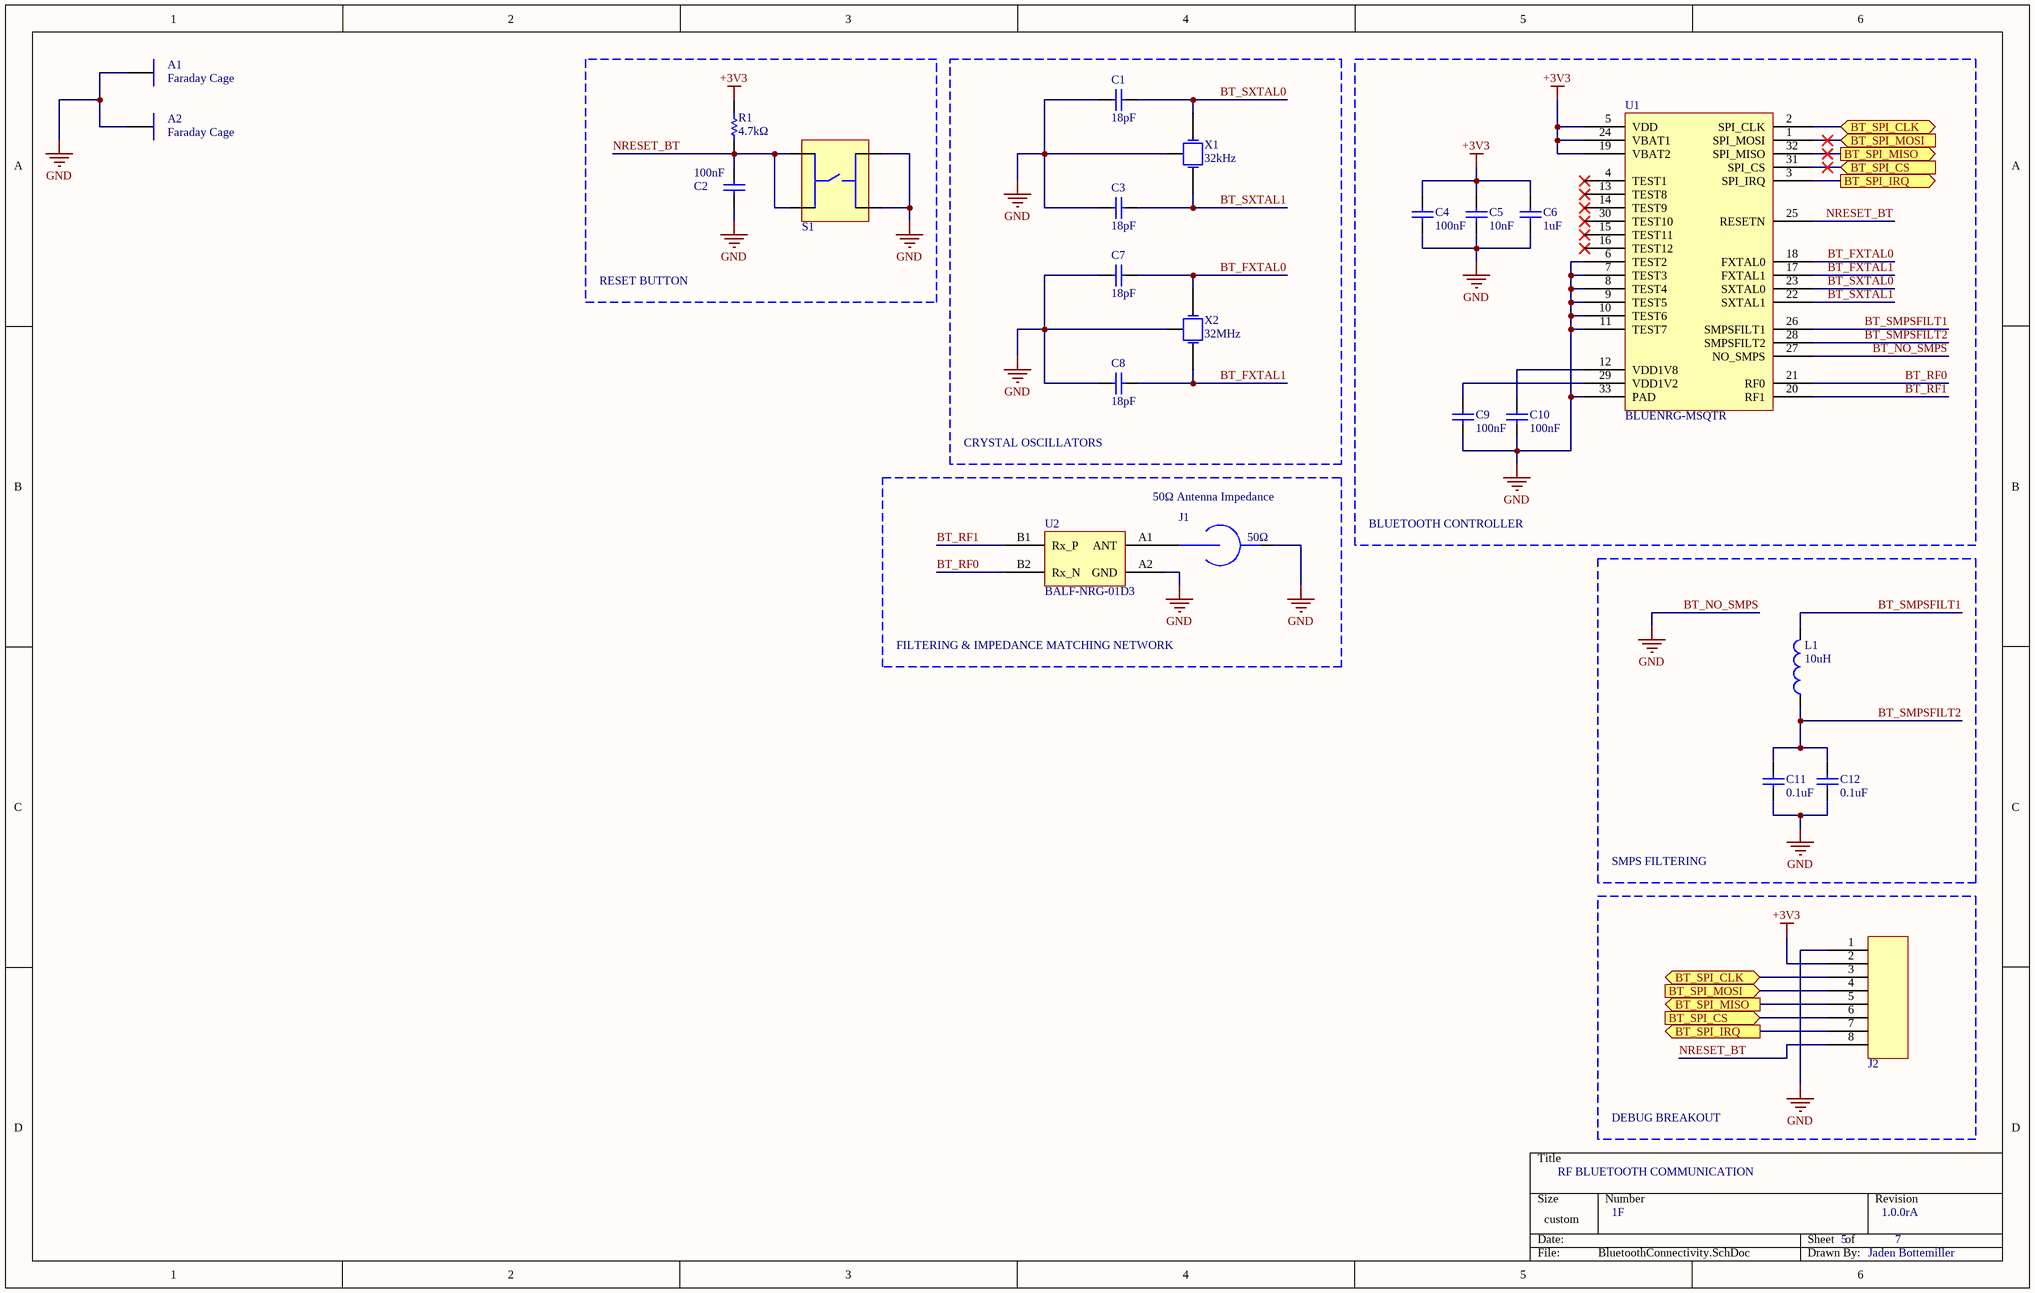
[diagram p4: BluetoothConnectivity.SchDoc]

### Parts
A1  Faraday Cage
A2  Faraday Cage
C1  value 18pF  (hidden comment: CAP)
C2  value 100nF  (hidden comment: CAP)
C3  value 18pF  (hidden comment: CAP)
C4  value 100nF  (hidden comment: CAP)
C5  value 10nF  (hidden comment: CAP)
C6  value 1uF  (hidden comment: CAP)
C7  value 18pF  (hidden comment: CAP)
C8  value 18pF  (hidden comment: CAP)
C9  value 100nF  (hidden comment: CAP)
C10  value 100nF  (hidden comment: CAP)
C11  value 0.1uF  (hidden comment: CAP)
C12  value 0.1uF  (hidden comment: CAP)
J1  Impedance: 50Ω  (hidden comment: Coaxial Connection)
J2  8 Pin Connector  (value not drawn)
L1  value 10uH  (hidden comment: IND)
R1  value 4.7kΩ  (hidden comment: RES)
S1  Pushbutton  (value not drawn)
U1  BLUENRG-MSQTR
U2  BALF-NRG-01D3
X1  value 32kHz  (hidden comment: Crystal Oscillator)
X2  value 32MHz  (hidden comment: Crystal Oscillator)

### Blocks framed on the sheet
RESET BUTTON: C2 R1 S1
CRYSTAL OSCILLATORS: C1 C3 C7 C8 X1 X2
BLUETOOTH CONTROLLER: C4-C6 C9 C10 U1
SMPS FILTERING: C11 C12 L1
DEBUG BREAKOUT: J2

### Ports
BT_SPI_CLK (bidir), BT_SPI_CS (in), BT_SPI_IRQ (out), BT_SPI_MISO (out), BT_SPI_MOSI (in)

### Nets
+3V3: C4.2 C5.2 C6.2 J2.2(Pin) R1.2 U1.5(VDD) U1.19(VBAT2) U1.24(VBAT1)  [project net VDDA_WA]
BT_NO_SMPS: A1.1(Pin) A2.1(Pin) C1.2 C2.1 C3.2 C4.1 C5.1 C6.1 C7.2 C8.2 C9.1 C10.1 C11.1 C12.1 J1.2 J2.1(Pin) S1.3(Pin) S1.4(Pin) U1.6(TEST2) U1.7(TEST3) U1.8(TEST4) U1.9(TEST5) U1.10(TEST6) U1.11(TEST7) U1.27(NO_SMPS) U1.33(PAD) U2.A2(GND) X1.3(GND) X2.3(GND)  [also labelled GND]
BT_FXTAL0: C7.1 U1.18(FXTAL0) X2.1(X1)
BT_FXTAL1: C8.1 U1.17(FXTAL1) X2.2(X2)
BT_RF0: U1.21(RF0) U2.B2(Rx_N)
BT_RF1: U1.20(RF1) U2.B1(Rx_P)
BT_SMPSFILT1: L1.2 U1.26(SMPSFILT1)
BT_SMPSFILT2: C11.2 C12.2 L1.1 U1.28(SMPSFILT2)
BT_SXTAL0: C1.1 U1.23(SXTAL0) X1.1(X1)
BT_SXTAL1: C3.1 U1.22(SXTAL1) X1.2(X2)
NRESET_BT: C2.2 J2.8(Pin) R1.1 S1.1 S1.2(Pin) U1.25(RESETN)
NetC9_2: C9.2 U1.29(VDD1V2)
NetC10_2: C10.2 U1.12(VDD1V8)
NetJ1_1: J1.1(Pin) U2.A1(ANT)
NetJ2_3: J2.3(Pin) U1.2(SPI_CLK) ; port BT_SPI_CLK
NetJ2_4: J2.4(Pin) U1.1(SPI_MOSI) ; port BT_SPI_MOSI
NetJ2_5: J2.5(Pin) U1.32(SPI_MISO) ; port BT_SPI_MISO
NetJ2_6: J2.6(Pin) U1.31(SPI_CS) ; port BT_SPI_CS
NetJ2_7: J2.7(Pin) U1.3(SPI_IRQ) ; port BT_SPI_IRQ

Not connected (* = marked no-connect by the designer): U1 4(TEST1)* 13(TEST8)* 14(TEST9)* 15(TEST11)* 16(TEST12)* 30(TEST10)*

### Notes on the sheet
- 50Ω Antenna Impedance
- FILTERING & IMPEDANCE MATCHING NETWORK
- RF BLUETOOTH COMMUNICATION
- 1F
- 5
- 1.0.0rA
- 7
- Jaden Bottemiller

### Library data of the parts
A1 A2 = Faraday Cage: Standard Faraday Cage
C1-C12 = CAP: Standard Capacitor
J1 = COAX: Coaxial Connection, e.g. to antennae
J2 = CONN_8PIN: Standard 8 Pin Connector
L1 = IND: Standard Inductor
R1 = RES: Standard Resistor; Tolerance: 1%
S1 = PUSHBTN_4T: Standard Pushbutton with 4 Terminals
U1 = BLUENRG-MSQTR: IC RF TxRx + MCU Bluetooth Bluetooth v4.1 2.4GHz 32-VFQFN Exposed Pad; ComponentLink1Description: DigiKey; ComponentLink1URL: https://www.digikey.com/product-detail/en/stmicroelectronics/BLUENRG-MSQTR/497-15639-1-ND/5267982; ComponentLink2Description: Datasheet; ComponentLink2URL: https://www.st.com/content/ccc/resource/technical/document/datasheet/e8/76/3d/fb/28/e0/40/0b/DM00141263.pdf/files/DM00141263.pdf/jcr:content/translations/en.DM00141263.pdf; ComponentLink3Description: SPI Interface; ComponentLink3URL: https://www.st.com/content/ccc/resource/technical/document/user_manual/6d/a1/5b/6c/dc/ab/48/76/DM00162667.pdf/files/DM00162667.pdf/jcr:content/translations/en.DM00162667.pdf
U2 = BALF-NRG-01D3: RF Balun 2.4GHz ~ 2.5GHz 50 / 50Ohm 4-WFBGA, FCBGA
X1 X2 = OSC_1GND: as X3 on sheet DebugProbe

## Sheet PowerRegulation.SchDoc
size 381 x 241 mm
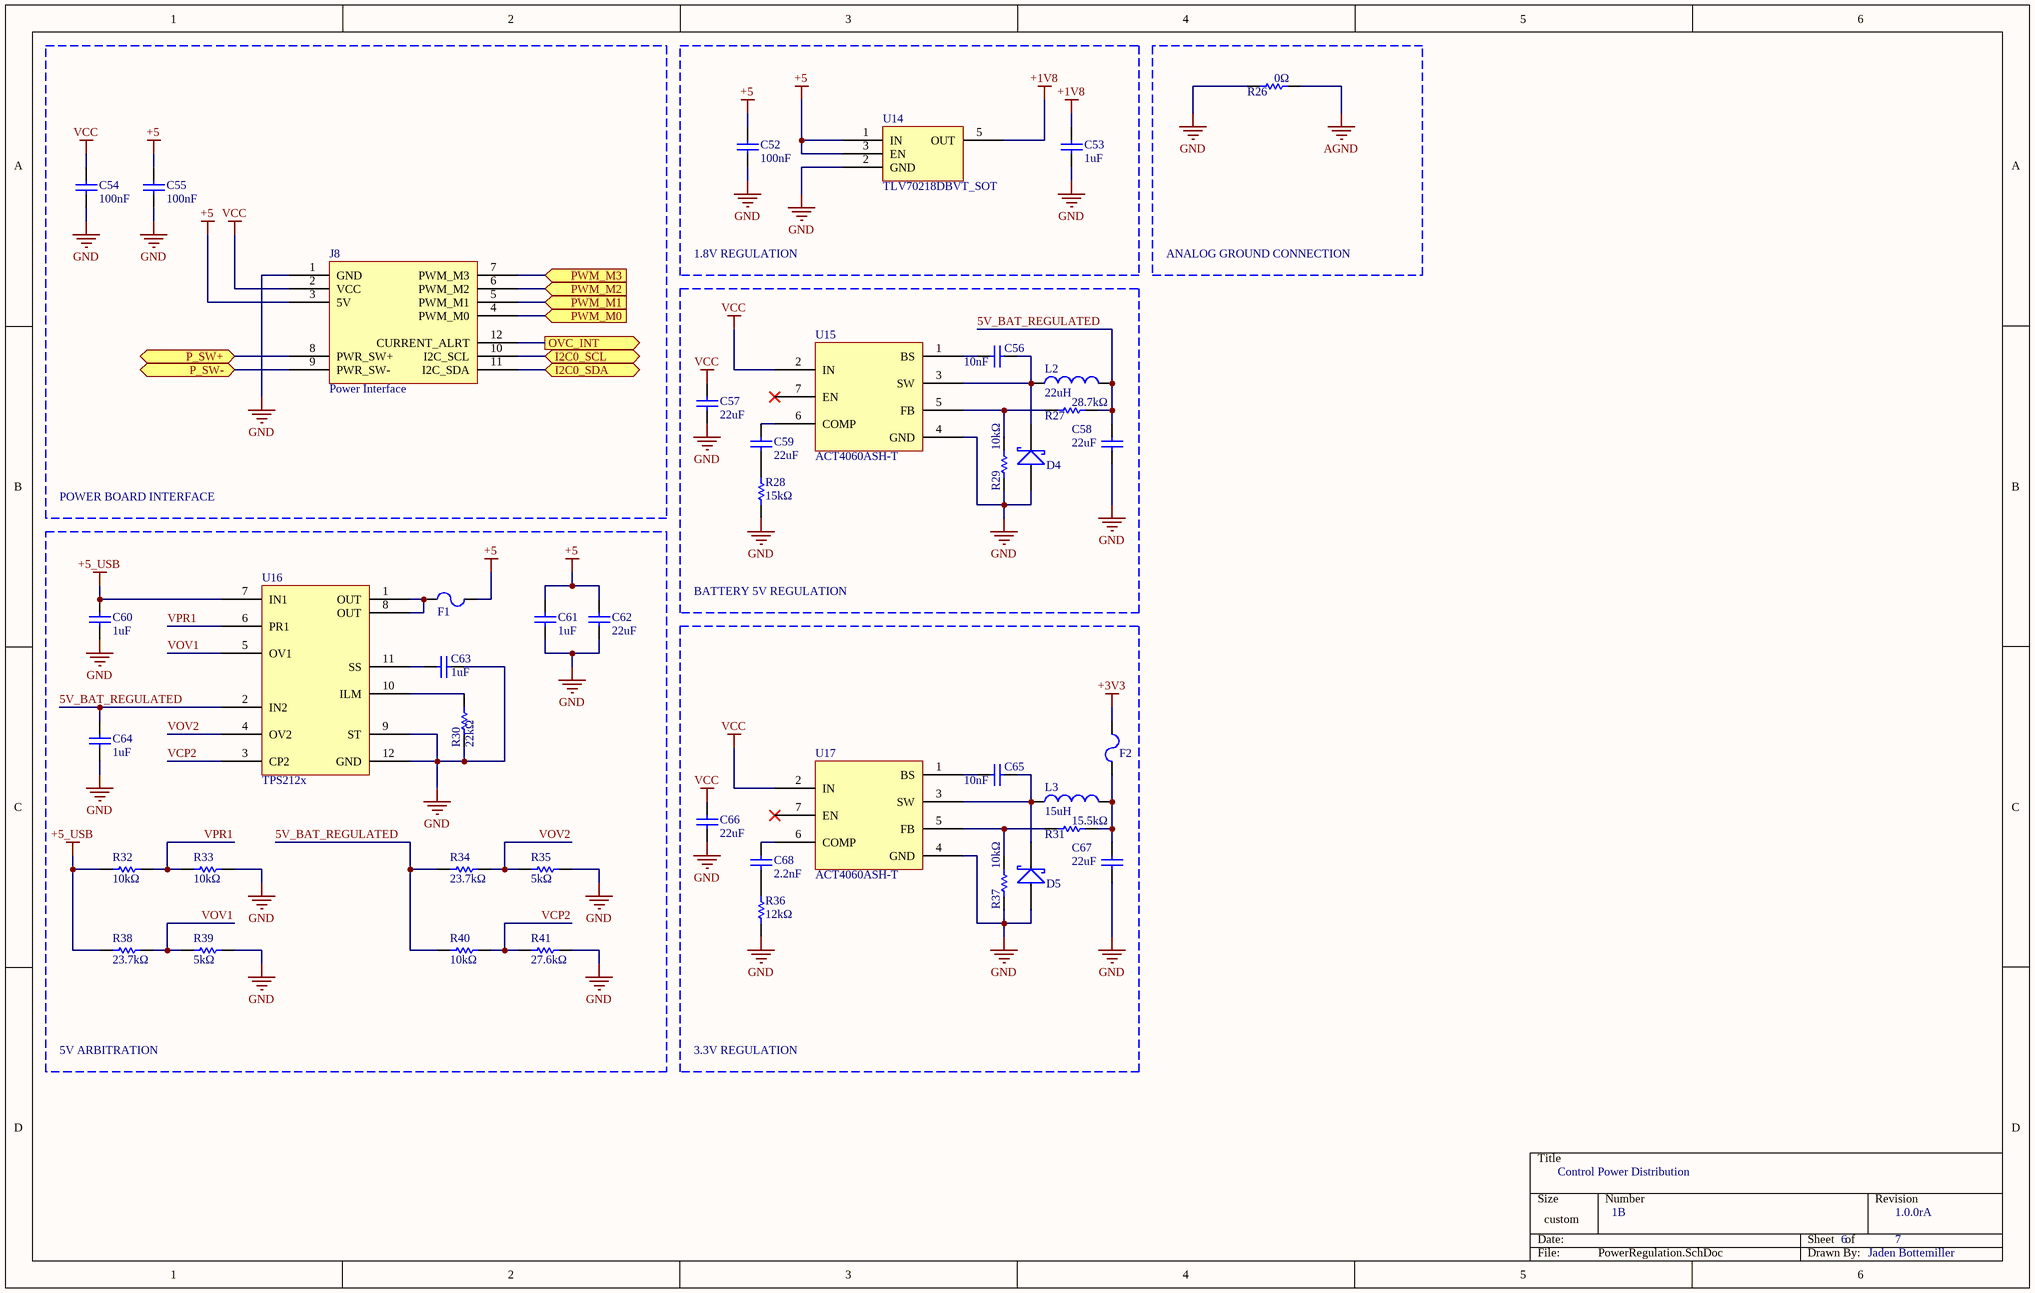
[diagram p5: PowerRegulation.SchDoc]

### Parts
C52  value 100nF  (hidden comment: CAP)
C53  value 1uF  (hidden comment: CAP)
C54  value 100nF  (hidden comment: CAP)
C55  value 100nF  (hidden comment: CAP)
C56  value 10nF  (hidden comment: CAP)
C57  value 22uF  (hidden comment: CAP)
C58  value 22uF  (hidden comment: CAP)
C59  value 22uF  (hidden comment: CAP)
C60  value 1uF  (hidden comment: CAP)
C61  value 1uF  (hidden comment: CAP)
C62  value 22uF  (hidden comment: CAP)
C63  value 1uF  (hidden comment: CAP)
C64  value 1uF  (hidden comment: CAP)
C65  value 10nF  (hidden comment: CAP)
C66  value 22uF  (hidden comment: CAP)
C67  value 22uF  (hidden comment: CAP)
C68  value 2.2nF  (hidden comment: CAP)
D4  Schottky Diode  (value not drawn)
D5  Schottky Diode  (value not drawn)
F1  FUSE  (value not drawn)
F2  FUSE  (value not drawn)
J8  Power Interface
L2  value 22uH  (hidden comment: IND)
L3  value 15uH  (hidden comment: IND)
R26  value 0Ω  (hidden comment: RES)
R27  value 28.7kΩ  (hidden comment: RES)
R28  value 15kΩ  (hidden comment: RES)
R29  value 10kΩ  (hidden comment: RES)
R30  value 22kΩ  (hidden comment: RES)
R31  value 15.5kΩ  (hidden comment: RES)
R32  value 10kΩ  (hidden comment: RES)
R33  value 10kΩ  (hidden comment: RES)
R34  value 23.7kΩ  (hidden comment: RES)
R35  value 5kΩ  (hidden comment: RES)
R36  value 12kΩ  (hidden comment: RES)
R37  value 10kΩ  (hidden comment: RES)
R38  value 23.7kΩ  (hidden comment: RES)
R39  value 5kΩ  (hidden comment: RES)
R40  value 10kΩ  (hidden comment: RES)
R41  value 27.6kΩ  (hidden comment: RES)
U14  TLV70218DBVT_SOT
U15  ACT4060ASH-T
U16  TPS212x
U17  ACT4060ASH-T

### Blocks framed on the sheet
POWER BOARD INTERFACE: C54 C55 J8
1.8V REGULATION: C52 C53 U14
ANALOG GROUND CONNECTION: R26
BATTERY 5V REGULATION: C56-C59 D4 L2 R27-R29 U15
5V ARBITRATION: C60-C64 F1 R30 R32-R35 R38-R41 U16
3.3V REGULATION: C65-C68 D5 F2 L3 R31 R36 R37 U17

### Ports
I2C0_SCL (bidir), I2C0_SDA (bidir), OVC_INT (out), P_SW+ (bidir), P_SW- (bidir), PWM_M0 (in), PWM_M1 (in), PWM_M2 (in), PWM_M3 (in)

### Nets
+1V8: C53.2 U14.5(OUT)
+3V3: F2.2  [project net VDDA_WA]
+5: C52.2 C55.2 C61.1 C62.1 F1.2 J8.3(5V) U14.1(IN) U14.3(EN)
+5_USB: C60.1 R32.2 R38.2 U16.7(IN1)
AGND: R26.1
GND: C52.1 C53.1 C54.1 C55.1 C57.1 C58.1 C60.2 C61.2 C62.2 C63.1 C64.2 C66.1 C67.1 D4.2(A) D5.2(A) J8.1(GND) R26.2 R28.1 R29.2 R30.1 R33.1 R35.1 R36.1 R37.2 R39.1 R41.1 U14.2(GND) U15.4(GND) U16.9(ST) U16.12(GND) U17.4(GND)  [project net BT_NO_SMPS]
VCC: C54.2 C57.2 C66.2 J8.2(VCC) U15.2(IN) U17.2(IN)
5V_BAT_REGULATED: C58.2 C64.1 L2.2 R27.1 R34.2 R40.2 U16.2(IN2)
VCP2: R40.1 R41.2 U16.3(CP2)
VOV1: R38.1 R39.2 U16.5(OV1)
VOV2: R34.1 R35.2 U16.4(OV2)
VPR1: R32.1 R33.2 U16.6(PR1)
NetC56_1: C56.1 U15.1(BS)
NetC56_2: C56.2 D4.1(K) L2.1 U15.3(SW)
NetC59_1: C59.1 R28.2
NetC59_2: C59.2 U15.6(COMP)
NetC63_2: C63.2 U16.11(SS)
NetC65_1: C65.1 U17.1(BS)
NetC65_2: C65.2 D5.1(K) L3.1 U17.3(SW)
NetC67_2: C67.2 F2.1 L3.2 R31.1
NetC68_1: C68.1 R36.2
NetC68_2: C68.2 U17.6(COMP)
NetF1_1: F1.1 U16.1(OUT) U16.8(OUT)
NetJ3_9: J8.8(PWR_SW+) ; port P_SW+
NetJ3_10: J8.9(PWR_SW-) ; port P_SW-
NetJ8_4: J8.4(PWM_M0) ; port PWM_M0
NetJ8_5: J8.5(PWM_M1) ; port PWM_M1
NetJ8_6: J8.6(PWM_M2) ; port PWM_M2
NetJ8_7: J8.7(PWM_M3) ; port PWM_M3
NetJ8_10: J8.10(I2C_SCL) ; port I2C0_SCL
NetJ8_11: J8.11(I2C_SDA) ; port I2C0_SDA
NetJ8_12: J8.12(CURRENT_ALRT) ; port OVC_INT
NetR27_2: R27.2 R29.1 U15.5(FB)
NetR30_2: R30.2 U16.10(ILM)
NetR31_2: R31.2 R37.1 U17.5(FB)

Not connected (* = marked no-connect by the designer): U14 4(NC); U15 7(EN)* 8(NC); U17 7(EN)* 8(NC)

### Notes on the sheet
- Control Power Distribution
- 1B
- 6
- 1.0.0rA
- 7
- Jaden Bottemiller

### Library data of the parts
C52-C68 = CAP: Standard Capacitor
D4 D5 = DIODE_SCHOTTKY: Standard Schottky Diode
F1 F2 = FUSE: Standard Fuse
J8 = PDB_INTERFACE: Interface between power board and control board.
L2 L3 = IND: Standard Inductor
R26-R41 = RES: Standard Resistor
U14 = TLV70218DBVT: Linear Voltage Regulator IC Positive Fixed 1 Output  300mA / SOT-23-5 ONLY (CHECK D/S FOR WSON); ComponentLink1Description: DigiKey; ComponentLink1URL: https://www.digikey.com/product-detail/en/texas-instruments/TLV70218DBVT/296-27889-1-ND/2425103; ComponentLink2Description: Datasheet; ComponentLink2URL: http://www.ti.com/lit/ds/symlink/tlv702.pdf
U15 U17 = ACT4060ASH-T: Buck Switching Regulator IC Positive Adjustable 1.293V 1 Output 2A; ComponentLink1Description: DigiKey; ComponentLink1URL: https://www.digikey.com/product-detail/en/active-semi-international-inc/ACT4060ASH-T/1488-1107-1-ND/7897251; ComponentLink2Description: Datasheet; ComponentLink2URL: https://active-semi.com/wp-content/uploads/ACT4060A_Datasheet.pdf
U16 = TPS212x: General Purpose PMIC - PWR MGMT BATTERY MGMT; ComponentLink1Description: DigiKey; ComponentLink1URL: https://www.digikey.com/product-detail/en/texas-instruments/TPS2121RUXR/296-53410-1-ND/9859004; ComponentLink2Description: Datasheet; ComponentLink2URL: http://www.ti.com/lit/ds/symlink/tps2120.pdf

## Sheet AuxilliaryLEDs.SchDoc
size 381 x 241 mm
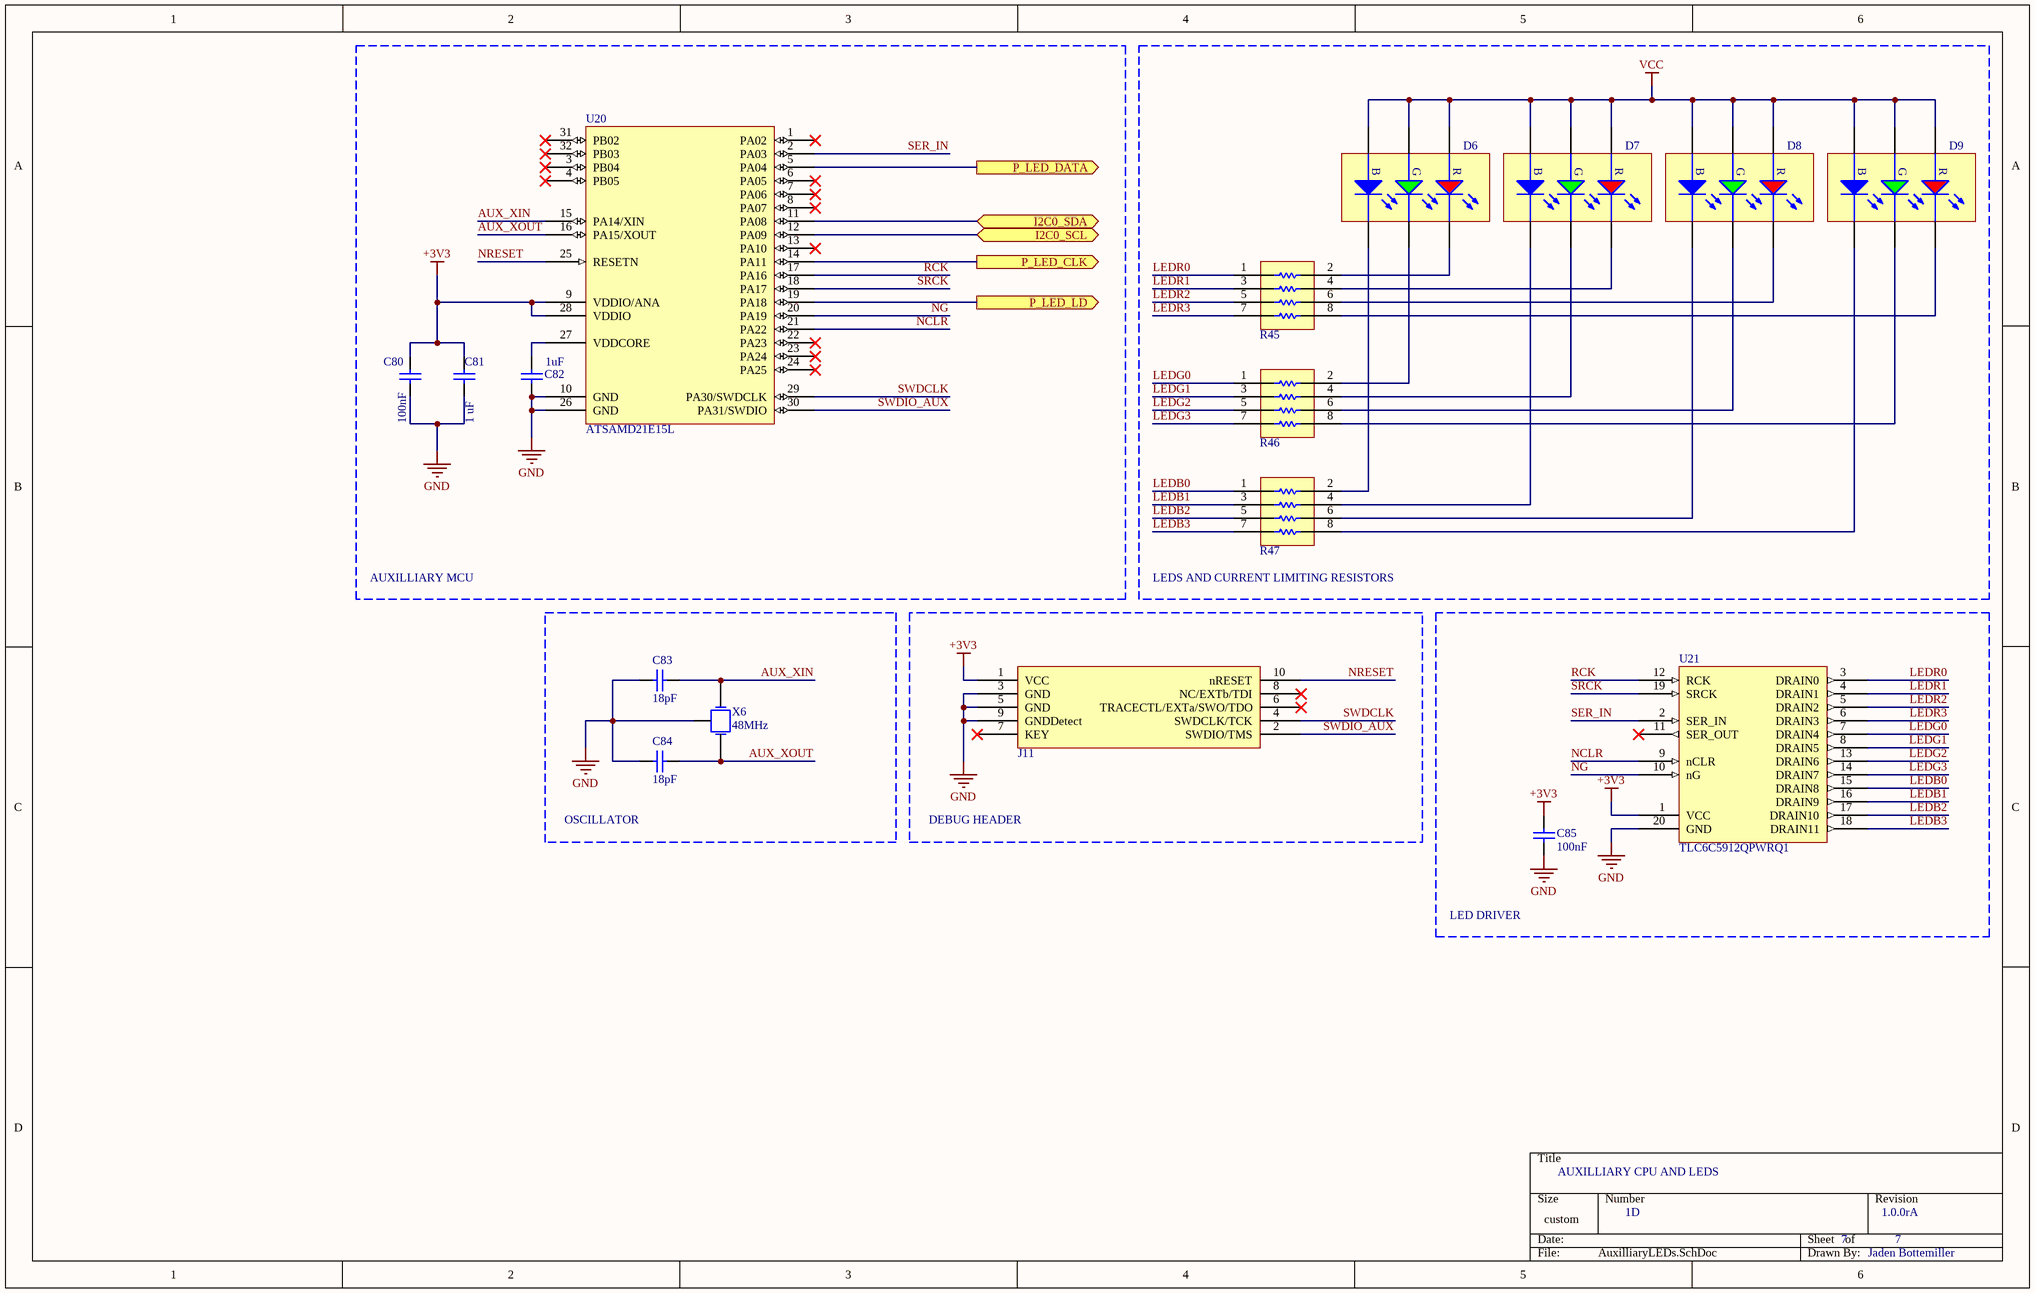
[diagram p6: AuxilliaryLEDs.SchDoc]

### Parts
C80  value 100nF  (hidden comment: CAP)
C81  value 1 uF  (hidden comment: CAP)
C82  value 1uF  (hidden comment: CAP)
C83  value 18pF  (hidden comment: CAP)
C84  value 18pF  (hidden comment: CAP)
C85  value 100nF  (hidden comment: CAP)
D6  RGB LED  (value not drawn)
D7  RGB LED  (value not drawn)
D8  RGB LED  (value not drawn)
D9  RGB LED  (value not drawn)
J11  Debug Connector  (value not drawn)
R45  RESNET  (value not drawn)
R46  RESNET  (value not drawn)
R47  RESNET  (value not drawn)
U20  ATSAMD21E15L
U21  TLC6C5912QPWRQ1
X6  value 48MHz  (hidden comment: Crystal Oscillator)

### Blocks framed on the sheet
AUXILLIARY MCU: C80-C82 U20
LEDS AND CURRENT LIMITING RESISTORS: D6-D9 R45-R47
OSCILLATOR: C83 C84 X6
DEBUG HEADER: J11
LED DRIVER: C85 U21

### Ports
I2C0_SCL (bidir), I2C0_SDA (bidir), P_LED_CLK (out), P_LED_DATA (out), P_LED_LD (out)

### Nets
+3V3: C80.2 C81.2 C85.2 J11.1(VCC) U20.9(VDDIO/ANA) U20.28(VDDIO) U21.1(VCC)  [project net VDDA_WA]
GND: C80.1 C81.1 C82.1 C83.2 C84.2 C85.1 J11.3(GND) J11.5(GND) J11.9(GNDDetect) U20.10(GND) U20.26(GND) U21.20(GND) X6.3(GND)  [project net BT_NO_SMPS]
VCC: D6.4(RA) D6.5(GA) D6.6(BA) D7.4(RA) D7.5(GA) D7.6(BA) D8.4(RA) D8.5(GA) D8.6(BA) D9.4(RA) D9.5(GA) D9.6(BA)
AUX_XIN: C83.1 U20.15(PA14/XIN) X6.1(X1)
AUX_XOUT: C84.1 U20.16(PA15/XOUT) X6.2(X2)
LEDB0: R47.1(Pin) U21.15(DRAIN8)
LEDB1: R47.3(Pin) U21.16(DRAIN9)
LEDB2: R47.5(Pin) U21.17(DRAIN10)
LEDB3: R47.7(Pin) U21.18(DRAIN11)
LEDG0: R46.1(Pin) U21.7(DRAIN4)
LEDG1: R46.3(Pin) U21.8(DRAIN5)
LEDG2: R46.5(Pin) U21.13(DRAIN6)
LEDG3: R46.7(Pin) U21.14(DRAIN7)
LEDR0: R45.1(Pin) U21.3(DRAIN0)
LEDR1: R45.3(Pin) U21.4(DRAIN1)
LEDR2: R45.5(Pin) U21.5(DRAIN2)
LEDR3: R45.7(Pin) U21.6(DRAIN3)
NCLR: U20.21(PA22) U21.9(nCLR)
NG: U20.20(PA19) U21.10(nG)
NRESET: J11.10(nRESET) U20.25(RESETN)
RCK: U20.17(PA16) U21.12(RCK)
SER_IN: U20.2(PA03) U21.2(SER_IN)
SRCK: U20.18(PA17) U21.19(SRCK)
SWDCLK: J11.4(SWDCLK/TCK) U20.29(PA30/SWDCLK)
SWDIO_AUX: J11.2(SWDIO/TMS) U20.30(PA31/SWDIO)
NetC82_2: C82.2 U20.27(VDDCORE)
NetD6_1: D6.1(BC) R47.2(Pin)
NetD6_2: D6.2(GC) R46.2(Pin)
NetD6_3: D6.3(RC) R45.2(Pin)
NetD7_1: D7.1(BC) R47.4(Pin)
NetD7_2: D7.2(GC) R46.4(Pin)
NetD7_3: D7.3(RC) R45.4(Pin)
NetD8_1: D8.1(BC) R47.6(Pin)
NetD8_2: D8.2(GC) R46.6(Pin)
NetD8_3: D8.3(RC) R45.6(Pin)
NetD9_1: D9.1(BC) R47.8(Pin)
NetD9_2: D9.2(GC) R46.8(Pin)
NetD9_3: D9.3(RC) R45.8(Pin)
NetJ3_6: U20.5(PA04) ; port P_LED_DATA
NetJ3_7: U20.14(PA11) ; port P_LED_CLK
NetJ3_8: U20.19(PA18) ; port P_LED_LD
NetJ8_10: U20.12(PA09) ; port I2C0_SCL
NetJ8_11: U20.11(PA08) ; port I2C0_SDA

Not connected (* = marked no-connect by the designer): J11 6(TRACECTL/EXTa/SWO/TDO)* 7(KEY)* 8(NC/EXTb/TDI)*; U20 1(PA02)* 3(PB04)* 4(PB05)* 6(PA05)* 7(PA06)* 8(PA07)* 13(PA10)* 22(PA23)* 23(PA24)* 24(PA25)* 31(PB02)* 32(PB03)*; U21 11(SER_OUT)*

### Notes on the sheet
- AUXILLIARY CPU AND LEDS
- 1D
- 7
- 1.0.0rA
- Jaden Bottemiller
- (in symbol RGB_LED) B; G; R

### Library data of the parts
C80-C85 = CAP: Standard Capacitor
D6-D9 = RGB_LED: 3-Channel LED (RGB)
J11 = Cortex-M Debug: 10-Pin Cortex-M Debug Connector
R45-R47 = RESNET4: Standard Resistor Network with 4 Resistors
U20 = ATSAMD21E15L: ARM® Cortex®-M0+ SAM D21E Microcontroller IC 32-Bit 48MHz 32KB (32K x 8) FLASH; ComponentLink1Description: DigiKey; ComponentLink1URL: https://www.digikey.com/product-detail/en/microchip-technology/ATSAMD21E15L-MNT/1611-ATSAMD21E15L-MNTCT-ND/6832783; ComponentLink2Description: Datasheet; ComponentLink2URL: http://ww1.microchip.com/downloads/en/DeviceDoc/SAMD21-Family-DataSheet-DS40001882D.pdf
U21 = TLC6C5912QPWRQ1: LED Driver IC 12 Output Linear Shift Register 50mA; ComponentLink1Description: DigiKey; ComponentLink1URL: https://www.digikey.com/product-detail/en/texas-instruments/TLC6C5912QPWRQ1/296-39249-1-ND/5143241; ComponentLink2Description: Datasheet; ComponentLink2URL: http://www.ti.com/lit/ds/symlink/tlc6c5912-q1.pdf
X6 = OSC_1GND: as X3 on sheet DebugProbe

## Nets that join several sheets
+1V8: MotionSense (5 pins), PowerRegulation (C53.2 U14.5)
+5: DebugProbe (C15.2 J3.2), PowerRegulation (8 pins)
+5_USB: DebugProbe (C14.2 J3.3 R2.2 U4.5), PowerRegulation (C60.1 R32.2 R38.2 U16.7)
AGND: WirelessConnectivity (C76.1 C77.1 J9.2), PowerRegulation (R26.1)
BT_NO_SMPS: FlightComputer (23 pins), DebugProbe (53 pins), MotionSense (27 pins), WirelessConnectivity (18 pins), BluetoothConnectivity (29 pins), PowerRegulation (31 pins), AuxilliaryLEDs (13 pins)
VCC: PowerRegulation (6 pins), AuxilliaryLEDs (12 pins)
VDDA_WA: FlightComputer (20 pins), DebugProbe (26 pins), MotionSense (11 pins), WirelessConnectivity (11 pins), BluetoothConnectivity (8 pins), PowerRegulation (F2.2), AuxilliaryLEDs (7 pins)
NetJ2_3: FlightComputer (U11.21), BluetoothConnectivity (J2.3 U1.2)
NetJ2_4: FlightComputer (U11.23), BluetoothConnectivity (J2.4 U1.1)
NetJ2_5: FlightComputer (U11.22), BluetoothConnectivity (J2.5 U1.32)
NetJ2_6: FlightComputer (U11.20), BluetoothConnectivity (J2.6 U1.31)
NetJ2_7: FlightComputer (R23.2 U11.17), BluetoothConnectivity (J2.7 U1.3)
NetJ3_6: DebugProbe (J3.6), AuxilliaryLEDs (U20.5)
NetJ3_7: DebugProbe (J3.7), AuxilliaryLEDs (U20.14)
NetJ3_8: DebugProbe (J3.8), AuxilliaryLEDs (U20.19)
NetJ3_9: DebugProbe (J3.9), PowerRegulation (J8.8)
NetJ3_10: DebugProbe (J3.10), PowerRegulation (J8.9)
NetJ8_4: FlightComputer (U11.8), PowerRegulation (J8.4)
NetJ8_5: FlightComputer (U11.9), PowerRegulation (J8.5)
NetJ8_6: FlightComputer (U11.10), PowerRegulation (J8.6)
NetJ8_7: FlightComputer (U11.11), PowerRegulation (J8.7)
NetJ8_10: FlightComputer (U11.58), MotionSense (U12.23 U13.4), PowerRegulation (J8.10), AuxilliaryLEDs (U20.12)
NetJ8_11: FlightComputer (U11.59), MotionSense (U12.24 U13.2), PowerRegulation (J8.11), AuxilliaryLEDs (U20.11)
NetJ8_12: FlightComputer (U11.28), PowerRegulation (J8.12)
NetJ10_3: FlightComputer (U11.24), WirelessConnectivity (J10.3 U18.26)
NetJ10_4: FlightComputer (U11.37), WirelessConnectivity (J10.4 U18.7)
NetJ10_6: FlightComputer (U11.27), WirelessConnectivity (J10.6 U18.14)
NetJ10_7: FlightComputer (U11.26), WirelessConnectivity (J10.7 U18.15)
NetJ10_8: FlightComputer (U11.25), WirelessConnectivity (J10.8 U18.25)
NetU11_57: FlightComputer (U11.57), MotionSense (U12.12)